# EAGLE design references-no-gnd-loop (EAGLE 7.7.0)
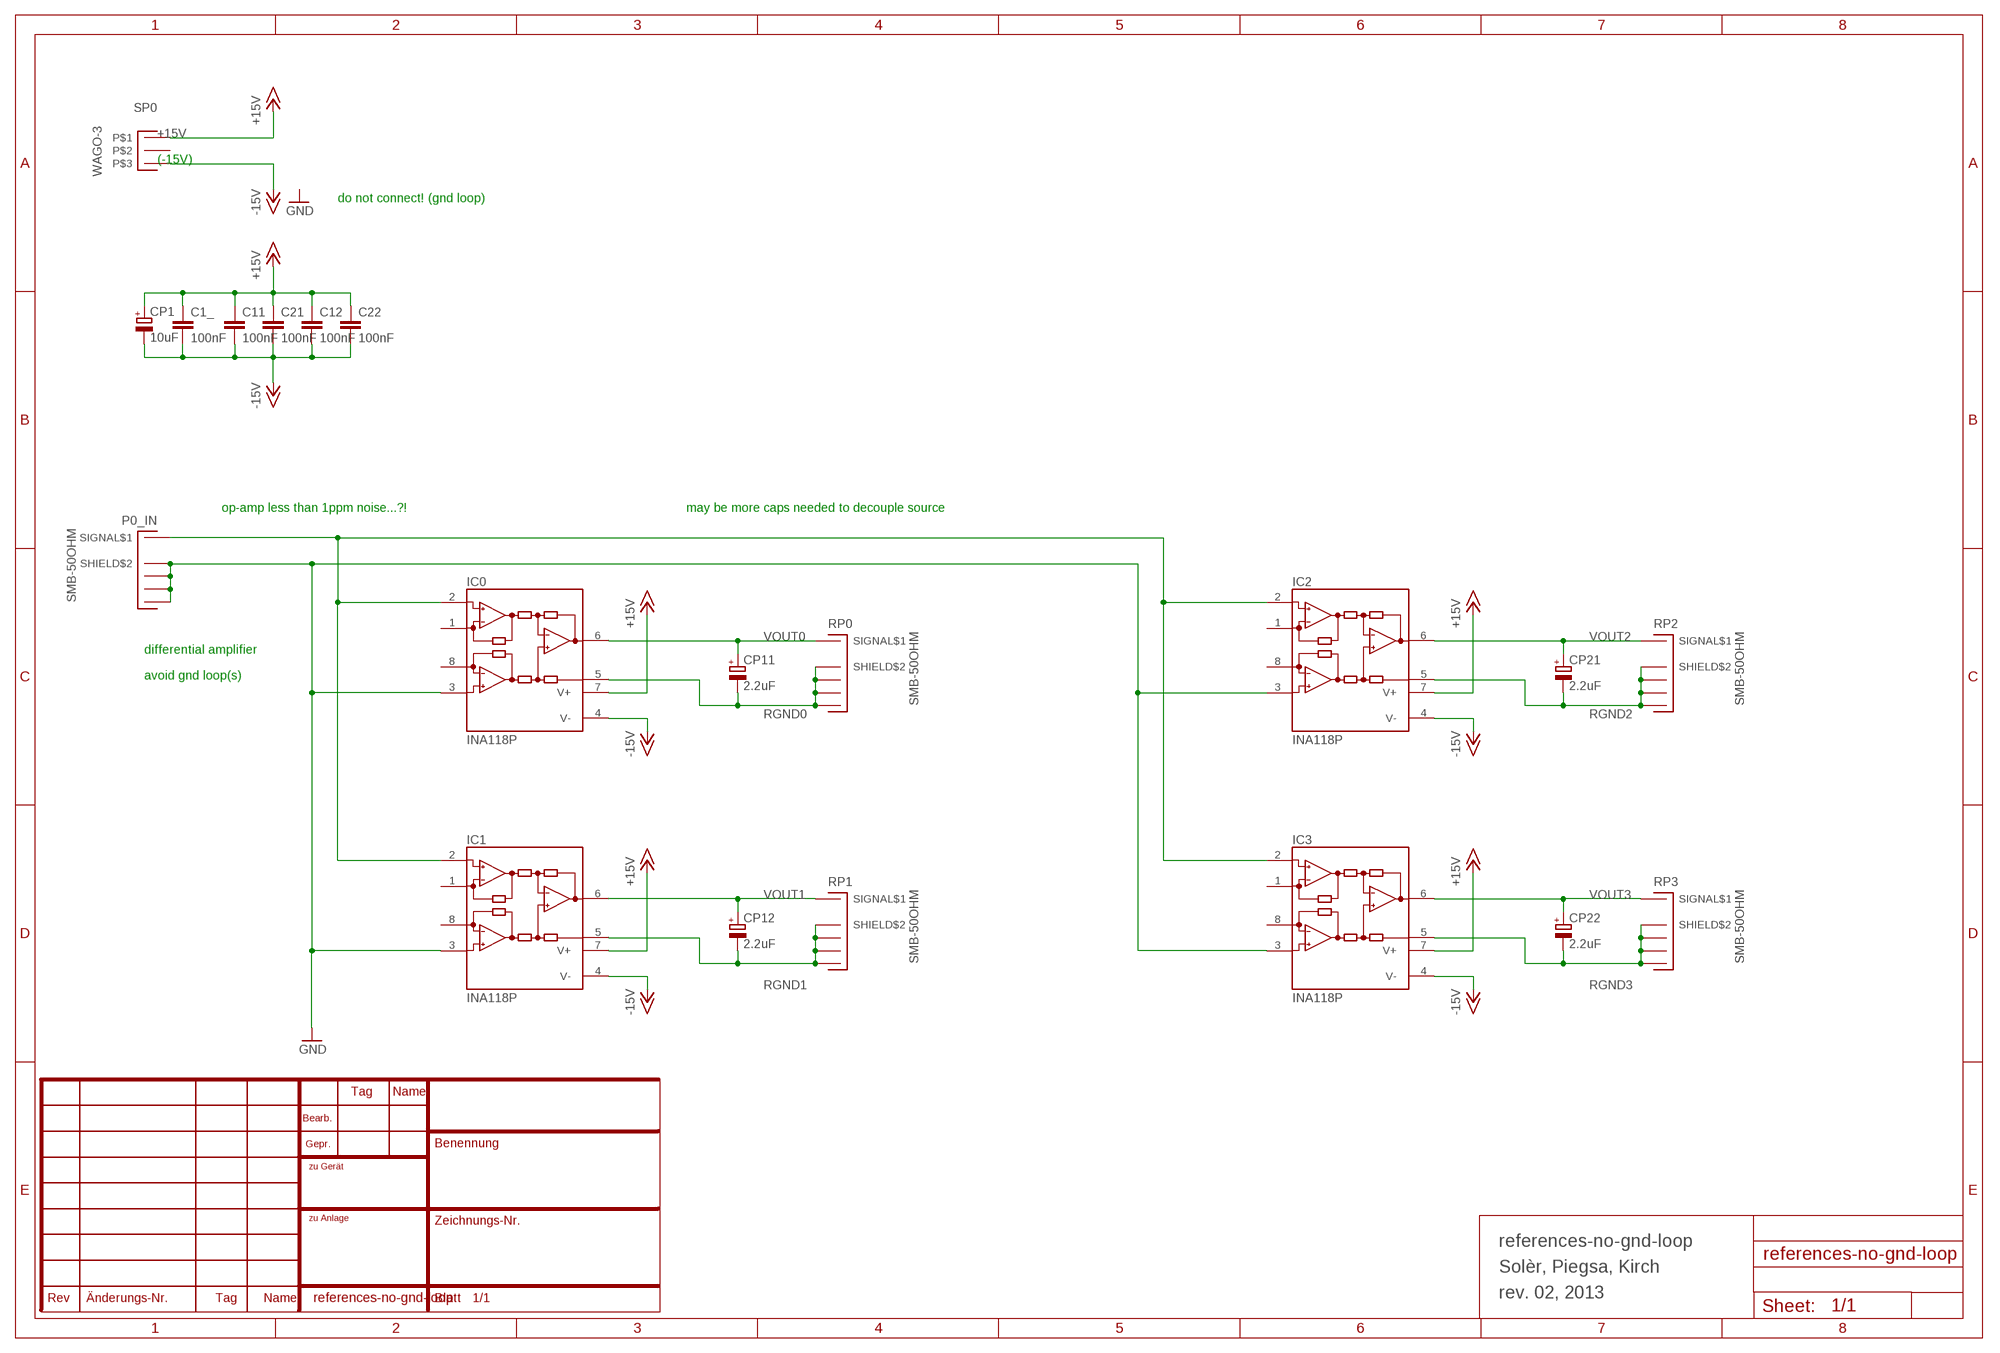
[diagram p0: schematic, sheet 1]

## Parts
C1_  100nF  C-EU050-025X075  [C050-025X075]
C11  100nF  C-EU050-025X075  [C050-025X075]
C12  100nF  C-EU050-025X075  [C050-025X075]
C21  100nF  C-EU050-025X075  [C050-025X075]
C22  100nF  C-EU050-025X075  [C050-025X075]
CP1  10uF  CPOL-EUB45181B  [B45181B]
CP11  2.2uF  CPOL-EUB45181B  [B45181B]
CP12  2.2uF  CPOL-EUB45181B  [B45181B]
CP21  2.2uF  CPOL-EUB45181B  [B45181B]
CP22  2.2uF  CPOL-EUB45181B  [B45181B]
IC0  INA118P  [DIL08]
IC1  INA118P  [DIL08]
IC2  INA118P  [DIL08]
IC3  INA118P  [DIL08]
P0_IN  SMB-50OHM  [B-30]
RP0  SMB-50OHM  [B-30]
RP1  SMB-50OHM  [B-30]
RP2  SMB-50OHM  [B-30]
RP3  SMB-50OHM  [B-30]
SP0  WAGO-3  [WAGO-3]

## Nets
+15V: C1_.1 C11.1 C12.1 C21.1 C22.1 CP1.+ IC0.7(V+) IC1.7(V+) IC2.7(V+) IC3.7(V+) SP0.P$1
+V1: IC0.2(-IN) IC1.2(-IN) IC2.2(-IN) IC3.2(-IN) P0_IN.P$1(SIGNAL$1)
-15V: C1_.2 C11.2 C12.2 C21.2 C22.2 CP1.- IC0.4(V-) IC1.4(V-) IC2.4(V-) IC3.4(V-) SP0.P$3
GND: IC0.3(+IN) IC1.3(+IN) IC2.3(+IN) IC3.3(+IN) P0_IN.P$2(SHIELD$2) P0_IN.P$3(SHIELD$3) P0_IN.P$4(SHIELD$4) P0_IN.P$5(SHIELD$5)
RGND0: CP11.- IC0.5(REF) RP0.P$2(SHIELD$2) RP0.P$3(SHIELD$3) RP0.P$4(SHIELD$4) RP0.P$5(SHIELD$5)
RGND1: CP12.- IC1.5(REF) RP1.P$2(SHIELD$2) RP1.P$3(SHIELD$3) RP1.P$4(SHIELD$4) RP1.P$5(SHIELD$5)
RGND2: CP21.- IC2.5(REF) RP2.P$2(SHIELD$2) RP2.P$3(SHIELD$3) RP2.P$4(SHIELD$4) RP2.P$5(SHIELD$5)
RGND3: CP22.- IC3.5(REF) RP3.P$2(SHIELD$2) RP3.P$3(SHIELD$3) RP3.P$4(SHIELD$4) RP3.P$5(SHIELD$5)
VOUT0: CP11.+ IC0.6(OUT) RP0.P$1(SIGNAL$1)
VOUT1: CP12.+ IC1.6(OUT) RP1.P$1(SIGNAL$1)
VOUT2: CP21.+ IC2.6(OUT) RP2.P$1(SIGNAL$1)
VOUT3: CP22.+ IC3.6(OUT) RP3.P$1(SIGNAL$1)
Unconnected: IC0.1(RG) IC0.8(RG) IC1.1(RG) IC1.8(RG) IC2.1(RG) IC2.8(RG) IC3.1(RG) IC3.8(RG) SP0.P$2

## Notes on the sheet
- (-15V)
- do not connect! (gnd loop)
- op-amp less than 1ppm noise...?! | may be more caps needed to decouple source
- differential amplifier
- avoid gnd loop(s)
- references-no-gnd-loop
- Solèr, Piegsa, Kirch
- rev. 02, 2013

## Library data of the parts
C1_ C11 C12 C21 C22 = rcl:C-EU: CAPACITOR, European symbol
CP1 CP11 CP12 CP21 CP22 = rcl:CPOL-EU: POLARIZED CAPACITOR, European symbol
IC0 IC1-IC3 = burr-brown:INA118: Instrumentation Amplifier Precision, Low Power; MF: TEXAS INSTRUMENTS; MPN: INA118P; OC_FARNELL: 1470354; OC_NEWARK: 96K4515
P0_IN RP0 RP1-RP3 = parts:SMB-50OHM
SP0 = parts:WAGO-3

## Board
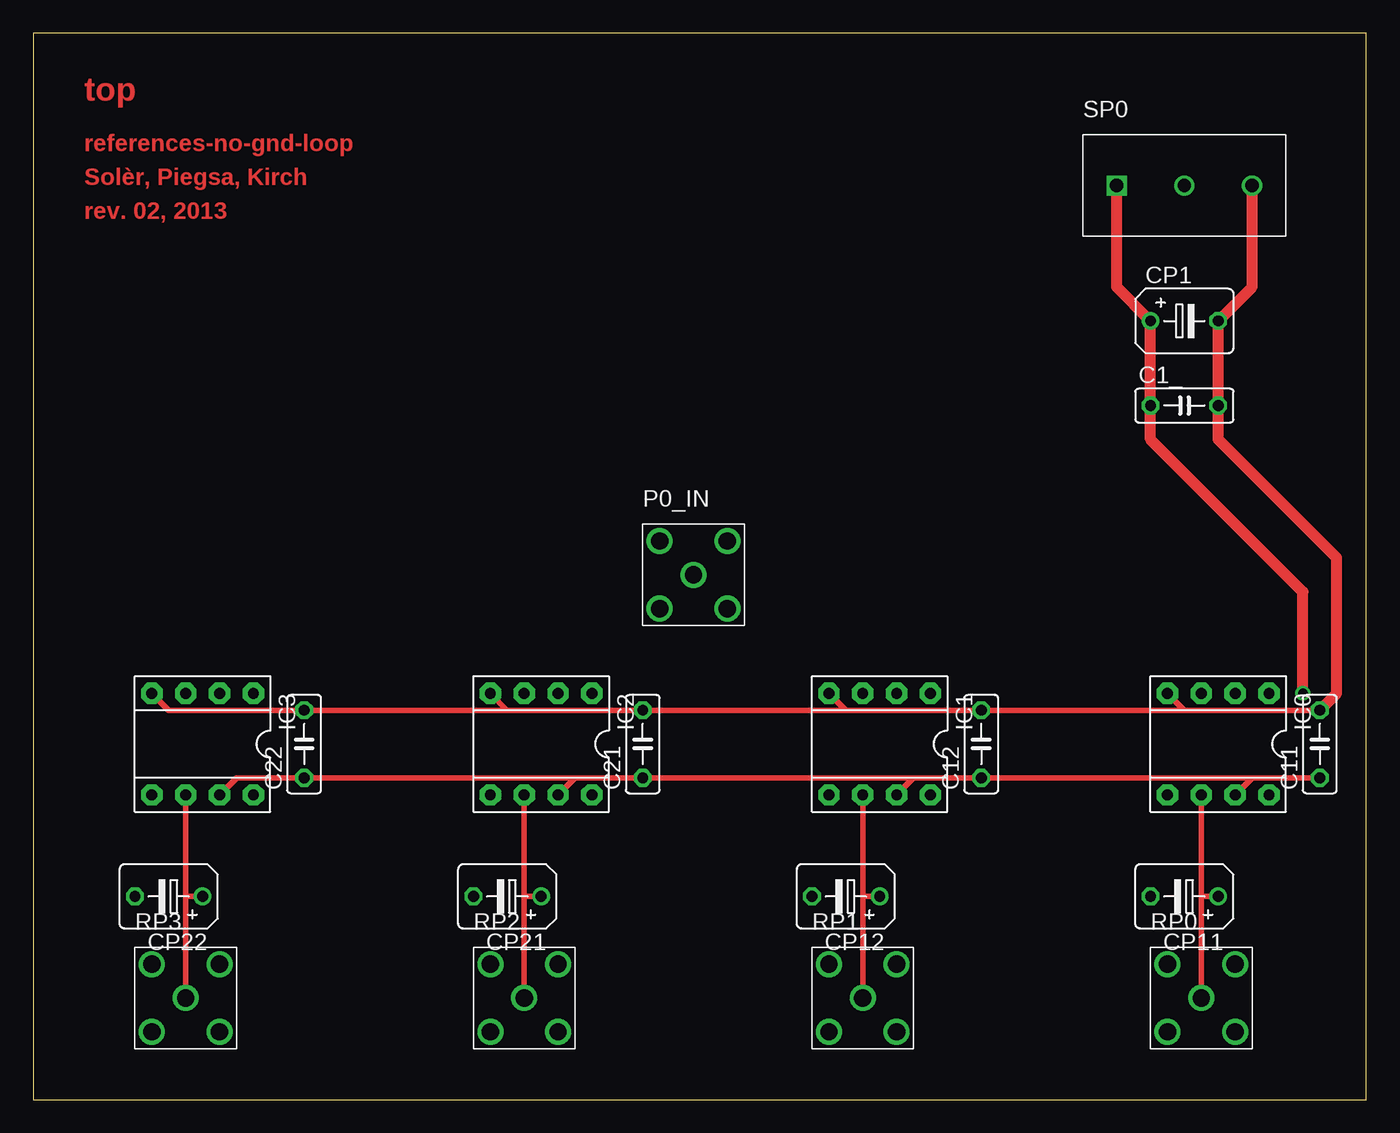
[diagram p1: board, top side]
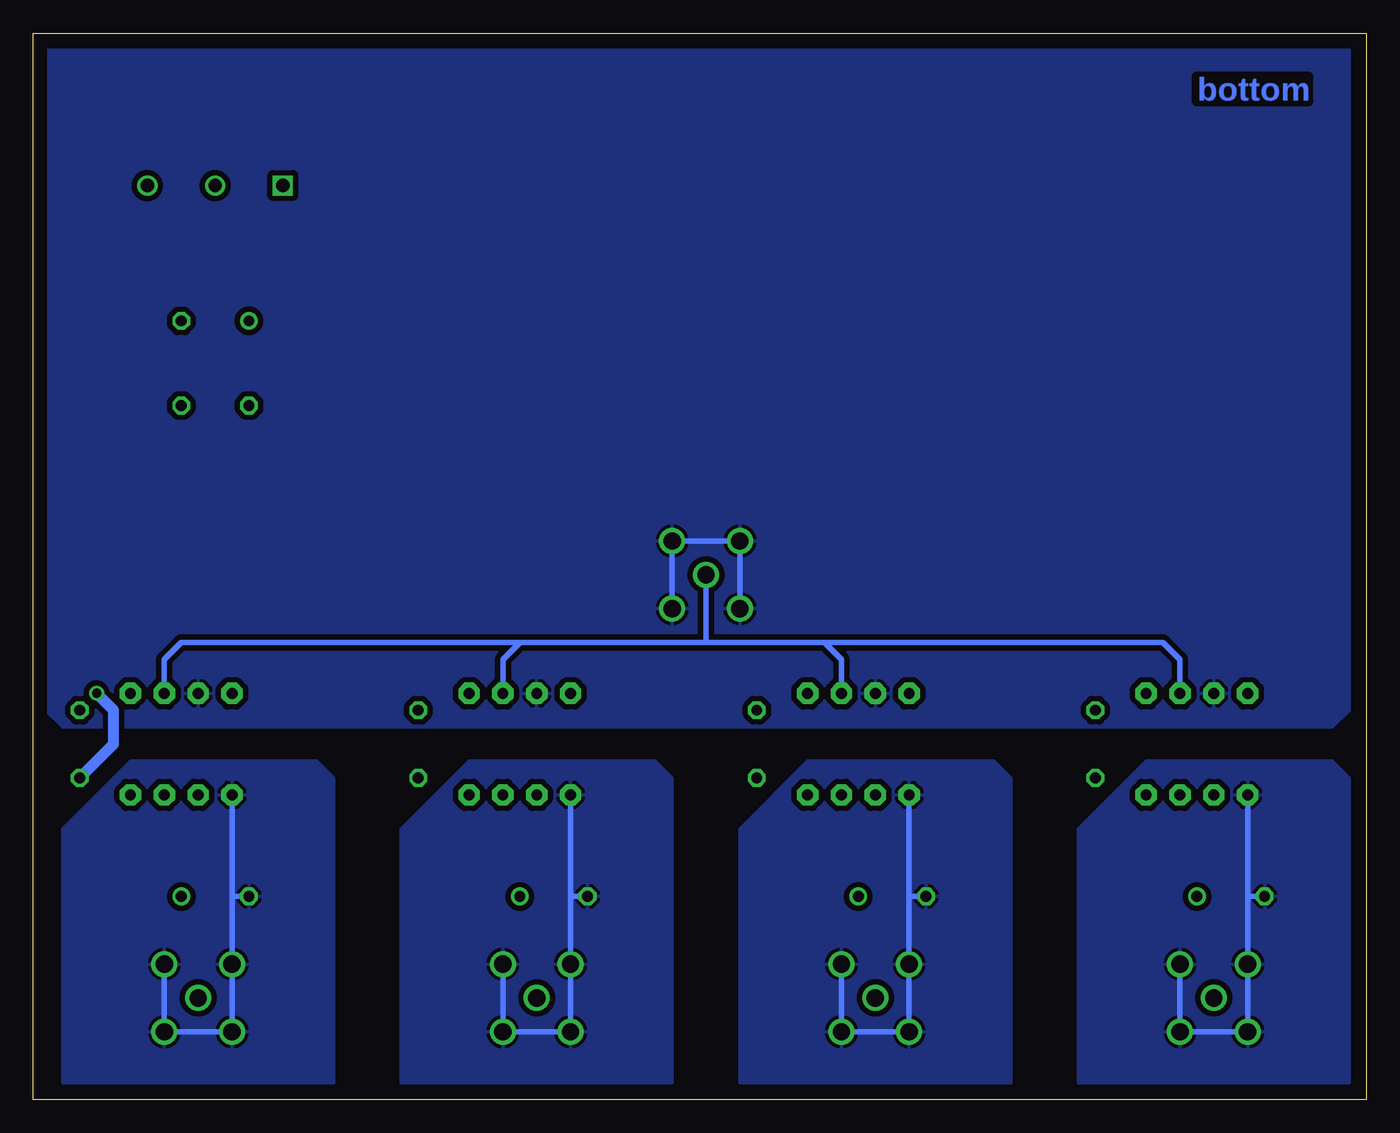
[diagram p2: board, bottom side, seen from below]

Size 100 x 80 mm. Coordinates in mm from the lower left corner, seen from the top.
Outline: 0,0 100,0 100,80 0,80 0,0
Copper layers (1*16): Top 0.035mm / dielectric 1.5mm / Bottom 0.035mm
Design rules "default": minimum track width 10mil, minimum drill 24mil, track to track 8mil, track to pad 8mil, pad to pad 8mil, via to via 8mil, smd to smd 8mil, copper to edge 40mil, drill to drill 8mil, minimum pad ring 10mil, minimum via ring 8mil, stop-mask expansion 4mil, vias tented up to drill 0mil, thermal gap 10mil

### Footprints (pad centres in the part's own frame; a part is rotated, then mirrored left to right if it is on the bottom)
C050-025X075 = drill 0.813 octagon: 1 -2.54,0; 2 2.54,0
B45181B = drill 0.813: + -2.54,0 | drill 0.813 octagon: - 2.54,0
DIL08 = drill 0.813 pad 1.6 octagon: 1 -3.81,-3.81; 2 -1.27,-3.81; 3 1.27,-3.81; 4 3.81,-3.81; 5 3.81,3.81; 6 1.27,3.81; 7 -1.27,3.81; 8 -3.81,3.81
B-30 = drill 1.3: P$1 0,0; P$2 -2.54,2.54; P$3 -2.54,-2.54; P$4 2.54,-2.54; P$5 2.54,2.54
WAGO-3 = drill 1 square: P$1 -5.08,0 | drill 1: P$2 0,0; P$3 5.08,0

### Placement (x,y rotation side)
C1_  86.36,52.07 0 top
C11  96.52,26.67 90 top
C12  71.12,26.67 90 top
C21  45.72,26.67 90 top
C22  20.32,26.67 90 top
CP1  86.36,58.42 0 top
CP11  86.36,15.24 180 top
CP12  60.96,15.24 180 top
CP21  35.56,15.24 180 top
CP22  10.16,15.24 180 top
IC0  88.9,26.67 180 top
IC1  63.5,26.67 180 top
IC2  38.1,26.67 180 top
IC3  12.7,26.67 180 top
P0_IN  49.53,39.37 0 top
RP0  87.63,7.62 0 top
RP1  62.23,7.62 0 top
RP2  36.83,7.62 0 top
RP3  11.43,7.62 0 top
SP0  86.36,68.58 0 top

### Tracks (layer width: path | path; a pad name or v marks a point on that pad's centre or on a via)
+15V  (via drill 0.7)
  Top 0.406: IC3.7 15.24,24.13 C22.1 40.64,24.13 | 40.64,24.13 C21.1 66.04,24.13 | 40.64,24.13 IC2.7 | 66.04,24.13 C12.1 91.44,24.13 | 66.04,24.13 IC1.7 | 91.44,24.13 C11.1 | 91.44,24.13 IC0.7
  Top 0.813: SP0.P$1 81.28,60.96 CP1.+ C1_.1 83.82,49.53 95.25,38.1 v95.25,30.48
  Bottom 0.813: v95.25,30.48 93.98,29.21 93.98,26.67 C11.1
+V1
  Bottom 0.406: 49.53,34.29 P0_IN.P$1 | 40.64,34.29 15.24,34.29 13.97,33.02 IC3.2 | 40.64,34.29 49.53,34.29 | IC2.2 39.37,33.02 40.64,34.29 | 49.53,34.29 63.5,34.29 | 63.5,34.29 88.9,34.29 90.17,33.02 IC0.2 | IC1.2 64.77,33.02 63.5,34.29
-15V
  Top 0.406: IC3.4 10.16,29.21 C22.2 C21.2 | C21.2 35.56,29.21 IC2.4 | C12.2 60.96,29.21 IC1.4 | IC0.4 86.36,29.21 C11.2 C12.2 | C21.2 C12.2
  Top 0.813: SP0.P$3 91.44,60.96 CP1.- C1_.2 88.9,49.53 97.79,40.64 97.79,30.48 C11.2
GND
  Bottom 0.406: P0_IN.P$4 P0_IN.P$5 P0_IN.P$2 P0_IN.P$3
  pour Bottom (isolate 0.406): 1.27,78.74 99.06,78.74 99.06,29.21 97.79,27.94 2.54,27.94 1.27,29.21
RGND0
  Bottom 0.406: RP0.P$5 RP0.P$4 RP0.P$3 RP0.P$2 85.09,15.24 | 85.09,15.24 IC0.5 | 85.09,15.24 CP11.-
  pour Bottom (isolate 0.406): 77.47,1.27 77.47,24.13 78.74,25.4 92.71,25.4 97.79,20.32 97.79,1.27
RGND1
  Bottom 0.406: 59.69,15.24 RP1.P$2 RP1.P$3 RP1.P$4 RP1.P$5 | 59.69,15.24 CP12.- | 59.69,15.24 IC1.5
  pour Bottom (isolate 0.406): 52.07,1.27 52.07,24.13 53.34,25.4 67.31,25.4 71.12,21.59 72.39,20.32 72.39,1.27
RGND2
  Bottom 0.406: RP2.P$5 RP2.P$4 RP2.P$3 RP2.P$2 34.29,15.24 | 34.29,15.24 IC2.5 | 34.29,15.24 CP21.-
  pour Bottom (isolate 0.406): 26.67,1.27 26.67,24.13 27.94,25.4 41.91,25.4 46.99,20.32 46.99,1.27
RGND3
  Bottom 0.406: 8.89,15.24 RP3.P$2 RP3.P$3 RP3.P$4 RP3.P$5 | 8.89,15.24 CP22.- | 8.89,15.24 IC3.5
  pour Bottom (isolate 0.406): 1.27,1.27 21.59,1.27 21.59,20.32 16.51,25.4 2.54,25.4 1.27,24.13
VOUT0
  Top 0.406: RP0.P$1 87.63,15.24 | 87.63,15.24 CP11.+ | 87.63,15.24 IC0.6
VOUT1
  Top 0.406: RP1.P$1 62.23,15.24 | 62.23,15.24 CP12.+ | 62.23,15.24 IC1.6
VOUT2
  Top 0.406: RP2.P$1 36.83,15.24 | 36.83,15.24 CP21.+ | 36.83,15.24 IC2.6
VOUT3
  Top 0.406: RP3.P$1 11.43,15.24 | 11.43,15.24 CP22.+ | 11.43,15.24 IC3.6

### Text on the board
Top: top | references-no-gnd-loop | Solèr, Piegsa, Kirch | rev. 02, 2013
Bottom: bottom